# Altium schematic sheet AES3_Transceiver.SchDoc
size A4; CompanyName: imaginary Audio; Organization: imaginary Audio; Address1: 6903 101 Ave NW; Address2: Edmonton; Address3: AB; Address4: T6A 0H6; DocumentNumber: 3; Revision: 0.1; SheetNumber: 3; SheetTotal: 4; Designer: Gabriel Bessette
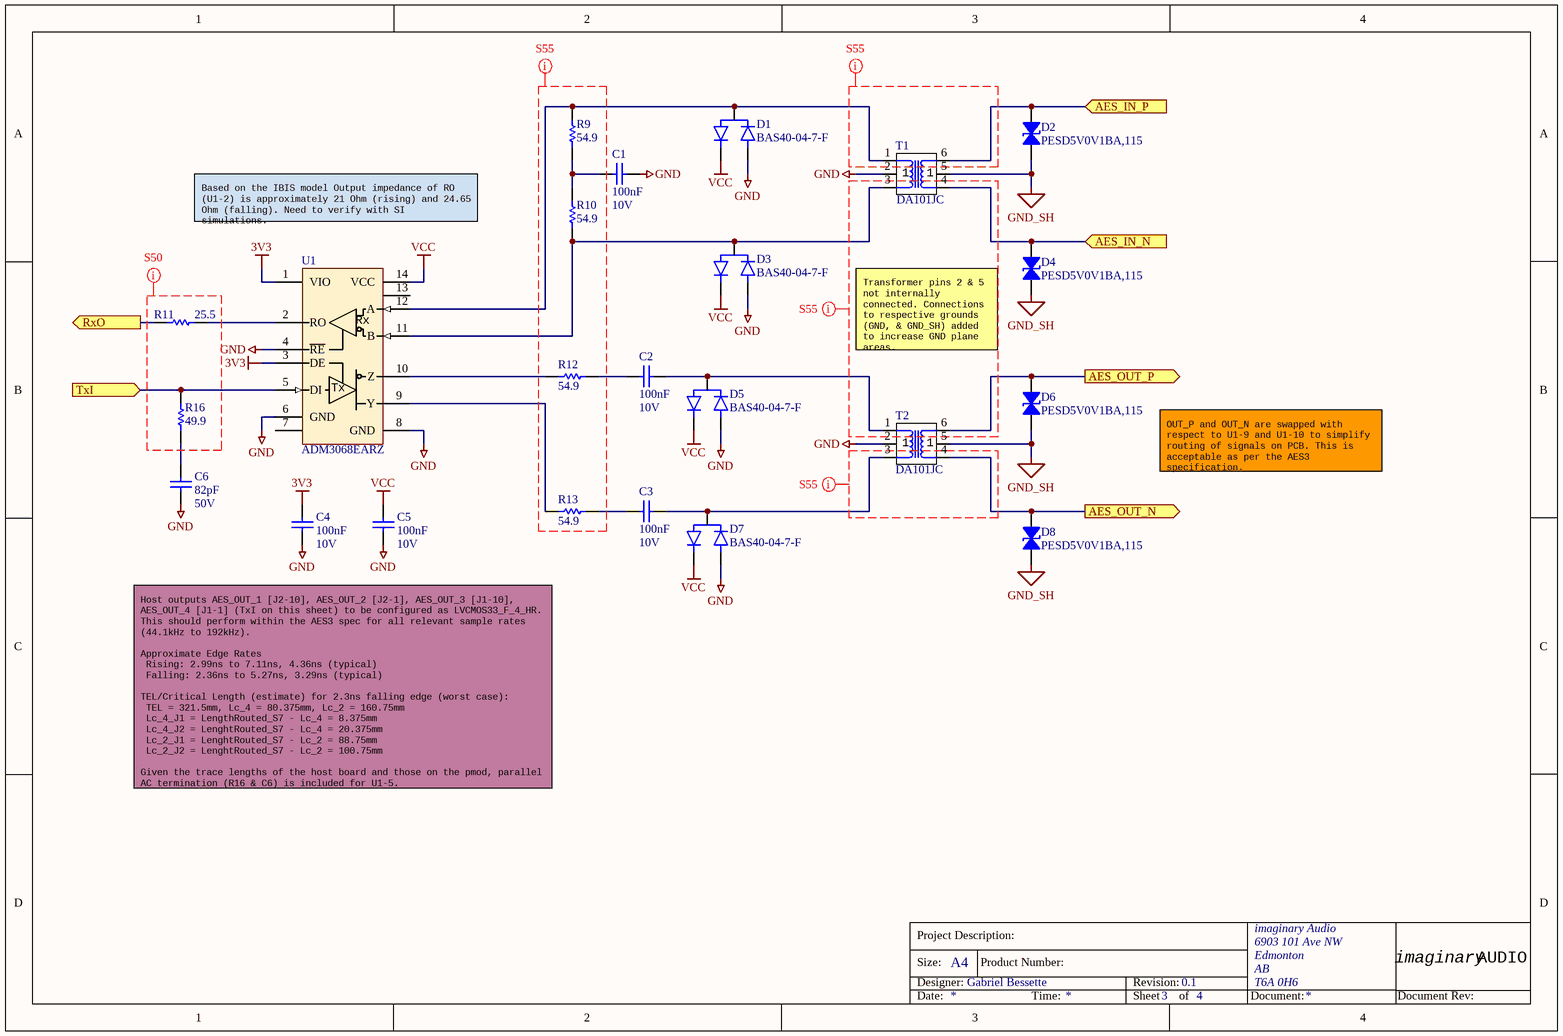
[diagram p0: AES3_Transceiver.SchDoc]

## Parts
C1  100nF  Voltage: 10V  [CAPC0603(1608)100_N]
C2  100nF  Voltage: 10V  [CAPC0603(1608)100_N]
C3  100nF  Voltage: 10V  [CAPC0603(1608)100_N]
C4  100nF  Voltage: 10V  [CAPC0603(1608)100_N]
C5  100nF  Voltage: 10V  [CAPC0603(1608)100_N]
C6  82pF  Voltage: 50V  [CAPC0603(1608)100_N]
D1  BAS40-04-7-F  [FP-SOT23-MFG]
D2  PESD5V0V1BA,115  [SOD323]
D3  BAS40-04-7-F  [FP-SOT23-MFG]
D4  PESD5V0V1BA,115  [SOD323]
D5  BAS40-04-7-F  [FP-SOT23-MFG]
D6  PESD5V0V1BA,115  [SOD323]
D7  BAS40-04-7-F  [FP-SOT23-MFG]
D8  PESD5V0V1BA,115  [SOD323]
R9  54.9  [RESC1608X55X30NL15T15]
R10  54.9  [RESC1608X55X30NL15T15]
R11  25.5  [RESC1608X55X30NL15T15]
R12  54.9  [RESC1608X55X30NL15T15]
R13  54.9  [RESC1608X55X30NL15T15]
R16  49.9  [RESC1608X55X30NL15T15]
T1  DA101JC  [DA101JC]
T2  DA101JC  [DA101JC]
U1  ADM3068EARZ  [SOIC127P600X175-14N]

## Ports
AES_IN_N (in), AES_IN_P (in), AES_OUT_N (out), AES_OUT_P (out), RxO (out), TxI (in)

## Nets
3V3: C4.2 U1.1(VIO) U1.3(DE)
GND: C1.2 C4.1 C5.1 C6.1 D1.1 D3.1 D5.1 D7.1 T1.2 T2.2 U1.4(~{RE}) U1.6(GND) U1.8(GND)
GND_SH: D2.2 D4.2 D6.2 D8.2 T1.5 T2.5
VCC: C5.2 D1.2 D3.2 D5.2 D7.2 U1.14(VCC)
AES_IN_N: D4.1 T1.4 ; port AES_IN_N
AES_IN_P: D2.1 T1.6 ; port AES_IN_P
AES_OUT_N: D8.1 T2.4 ; port AES_OUT_N
AES_OUT_P: D6.1 T2.6 ; port AES_OUT_P
RxO: R11.1 ; port RxO
TxI: R16.2 U1.5(DI) ; port TxI
NetC1_1: C1.1 R9.1 R10.2
NetC2_1: C2.1 R12.1
NetC2_2: C2.2 D5.3 T2.1
NetC3_1: C3.1 R13.1
NetC3_2: C3.2 D7.3 T2.3
NetC6_2: C6.2 R16.1
NetD1_3: D1.3 R9.2 T1.1 U1.12(A)
NetD3_3: D3.3 R10.1 T1.3 U1.11(B)
NetR11_2: R11.2 U1.2(RO)
NetR12_2: R12.2 U1.10(Z)
NetR13_2: R13.2 U1.9(Y)

Not connected (* = marked no-connect by the designer): U1 7(NIC) 13(NIC)

## Layout directives
net class S55: (no net found under the mark)
net class S50: (no net found under the mark)

## Notes on the sheet
- Based on the IBIS model Output impedance of RO (U1-2) is approximately 21 Ohm (rising) and 24.65 Ohm (falling). Need to verify with SI simulations.
- (near D4) Transformer pins 2 & 5 not internally connected. Connections to respective grounds (GND, & GND_SH) added to increase GND plane areas.
- OUT_P and OUT_N are swapped with respect to U1-9 and U1-10 to simplify routing of signals on PCB. This is acceptable as per the AES3 specification.
- Host outputs AES_OUT_1 [J2-10], AES_OUT_2 [J2-1], AES_OUT_3 [J1-10], AES_OUT_4 [J1-1] (TxI on this sheet) to be configured as LVCMOS33_F_4_HR. This should perform within the AES3 spec for all relevant sample rates (44.1kHz to 192kHz).
  Approximate Edge Rates
  Rising: 2.99ns to 7.11ns, 4.36ns (typical)
  Falling: 2.36ns to 5.27ns, 3.29ns (typical)
  TEL/Critical Length (estimate) for 2.3ns falling edge (worst case):
  TEL = 321.5mm, Lc_4 = 80.375mm, Lc_2 = 160.75mm
  Lc_4_J1 = LengthRouted_S7 - Lc_4 = 8.375mm
  Lc_4_J2 = LenghtRouted_S7 - Lc_4 = 20.375mm
  Lc_2_J1 = LenghtRouted_S7 - Lc_2 = 88.75mm
  Lc_2_J2 = LenghtRouted_S7 - Lc_2 = 100.75mm
  Given the trace lengths of the host board and those on the pmod, parallel AC termination (R16 & C6) is included for U1-5.
- Project Description:
- Size:
- Designer:
- A4
- Product Number:
- Revision:
- imaginary
- AUDIO
- Date:
- Time:
- Sheet
- of
- Document:
- Document Rev:
- (in symbol ADM3068EARZ) Rx; Tx

## Library data of the parts
C1-C5 = CAP: KEMET - C0603C104K8RACTU - SMD Multilayer Ceramic Capacitor, 0.1 µF, 10 V, 0603 [1608 Metric], ± 10%, X7R, C Series KEMET; Dissipation Factor: 5%; Max Thickness: 1 mm; Value: 100nF; Technology: SMT; Supplier 1: Digi-Key; Supplier Part Number 1: 399-1095-1-ND; Manufacturer: KEMET; Manufacturer Part Number: C0603C104K8RACTU; RoHS: Yes; Category: Ceramic Capacitors; Stock 1: 795093; Pricing 1: 1=0.12000, 10=0.08500, 50=0.04860, 100=0.04020, 500=0.02818, 1000=0.02333 (USD); Mount: Surface Mount,PCB; Case/Package: 0603; Number of Pins: 2; Case Code (Imperial): 0603; Case Code (Metric): 1608; Contact Plating: Tin,Matte; Dielectric Material: Ceramic; Min Operating Temperature: -55°C; Max Operating Temperature: 125°C; Capacitance: 100nF; Tolerance: 10%; Voltage Rating: 10V; Packaging: Tape and Reel; Package Quantity: 1; Voltage Rating (DC): 10V; Dielectric: X7R; Termination: SMD/SMT; Length: 1.6mm; Height: 0.8mm; Width: 0.8mm; Lead Pitch: 0.7mm; Thickness: 0.034inch; Depth: 0.8mm; Radiation Hardening: No; REACH SVHC: No SVHC; ComponentLink1URL: https://datasheet.ciiva.com/6093/1776114-6093269.pdf?src-supplier=Farnell; ComponentLink1Description: https://datasheet.ciiva.com/6093/1776114-6093269.pdf?src-supplier=Farnell; ComponentLink2URL: https://datasheet.ciiva.com/7823/kem-c1002-x7r-smd-7823989.pdf?src-supplier=Element14; ComponentLink2Description: https://datasheet.ciiva.com/7823/kem-c1002-x7r-smd-7823989.pdf?src-supplier=Element14; ComponentLink3URL: https://datasheet.ciiva.com/18192/getdatasheetpartid-91529-18192711.pdf?src-supplier=Verical; ComponentLink3Description: https://datasheet.ciiva.com/18192/getdatasheetpartid-91529-18192711.pdf?src-supplier=Verical; ComponentLink4URL: https://datasheet.ciiva.com/5419/kem-c1002-x7r-smd-357932-5419657.pdf?src-supplier=Mouser; ComponentLink4Description: https://datasheet.ciiva.com/5419/kem-c1002-x7r-smd-357932-5419657.pdf?src-supplier=Mouser; ComponentLink5URL: https://datasheet.ciiva.com/14589/70095383-14589402.pdf?src-supplier=Allied+Electronics; ComponentLink5Description: https://datasheet.ciiva.com/14589/70095383-14589402.pdf?src-supplier=Allied+Electronics; ComponentLink6URL: https://datasheet.ciiva.com/14593/70095383-14593978.pdf?src-supplier=Allied+Electronics; ComponentLink6Description: https://datasheet.ciiva.com/14593/70095383-14593978.pdf?src-supplier=Allied+Electronics
C6 = CAP: KEMET - C0603C820J5GACTU - Keramikvielschichtkondensator, SMD, 82 pF, 50 V, 0603 [Metrisch 1608], ± 5%, C0G / NP0; Dielectric Material: Ceramic; Temperature Coefficient: 30ppm/°C; Dissipation Factor: 0.1%; Max Thickness: 1 mm; Value: 82pF; Technology: SMT; Supplier 1: Digi-Key; Supplier Part Number 1: 399-1060-1-ND; Manufacturer: KEMET; Manufacturer Part Number: C0603C820J5GACTU; RoHS: Yes; Category: Ceramic Capacitors; Stock 1: 36463; Pricing 1: 1=0.10000, 10=0.05300, 50=0.02900, 100=0.02370, 500=0.01694, 1000=0.01331 (USD); Mount: Surface Mount,PCB; Case/Package: 0603; Number of Pins: 2; Case Code (Metric): 1608; Case Code (Imperial): 0603; Contact Material: Tin; Min Operating Temperature: -55°C; Max Operating Temperature: 125°C; Package Quantity: 1; Capacitance: 82pF; Voltage Rating: 50V; Tolerance: 5%; Packaging: Tape and Reel; Voltage Rating (DC): 50V; Dielectric: C0G; Termination: SMD/SMT; Length: 1.6mm; Width: 0.031inch; Height: 0.8mm; Thickness: 0.034inch; Lead Pitch: 0.7mm; Depth: 0.8mm; Radiation Hardening: No; REACH SVHC: No SVHC; Lead Free: Lead Free; ComponentLink1URL: https://datasheet.ciiva.com/144/docfinderpartnumber-c0603c820j5gactu-144400.pdf?src-supplier=Digi-Key; ComponentLink1Description: https://datasheet.ciiva.com/144/docfinderpartnumber-c0603c820j5gactu-144400.pdf?src-supplier=Digi-Key; ComponentLink2URL: https://datasheet.ciiva.com/26948/getdatasheetpartid-385592-26948455.pdf?src-supplier=Verical; ComponentLink2Description: https://datasheet.ciiva.com/26948/getdatasheetpartid-385592-26948455.pdf?src-supplier=Verical; ComponentLink3URL: https://datasheet.ciiva.com/28696/1789732-28696009.pdf?src-supplier=Element14; ComponentLink3Description: https://datasheet.ciiva.com/28696/1789732-28696009.pdf?src-supplier=Element14; ComponentLink4URL: https://datasheet.ciiva.com/5420/kem-c1003-c0g-smd-356956-5420651.pdf?src-supplier=Mouser; ComponentLink4Description: https://datasheet.ciiva.com/5420/kem-c1003-c0g-smd-356956-5420651.pdf?src-supplier=Mouser; ComponentLink5URL: https://datasheet.ciiva.com/22705/1907778-22705499.pdf?src-supplier=Element14; ComponentLink5Description: https://datasheet.ciiva.com/22705/1907778-22705499.pdf?src-supplier=Element14; ComponentLink6URL: https://datasheet.ciiva.com/7823/40889-7823855.pdf?src-supplier=Element14; ComponentLink6Description: https://datasheet.ciiva.com/7823/40889-7823855.pdf?src-supplier=Element14
D1 D3 D5 D7 = BAS40-04-7-F: DIODE SCHOTTKY 40V 350MW SOT23-3; Manufacturer: Diodes Inc.; Automotive Grade: Grade 1; Forward Current: 200mA; Max Junction Temp: +125°C; Peak Reverse Current: 0.02uA; VALUE: 4pF; Standoff Height: 0.013mm; Max Surge Forward Current: 600mA; Reverse Recovery Time: 5ns; Max Reverse Current: 200nA; Forward Voltage: 1V; ComponentLink2Description: Datasheet; Temperature Range High: +125°C; Mouser Description: Schottky Diodes & Rectifiers 40V 350mW; Reverse Voltage: 40V; Device Class L3: Schottky Diodes; Package: SOT23; Automotive: Yes; Max Repetitive Reverse Voltage: 40V; Height: 1.1mm; RoHS: TRUE; Device Class L1: Discrete Semiconductors; Temperature Range Low: -55°C; Digikey Description: DIODE ARRAY SCHOTTKY 40V SOT23-3; Lead Free: Yes; Category: Diode; Octopart: https://octopart.com/bas40-04-7-f-diodes+inc.-325979; Device Class L2: Diodes; Capacitance: 4pF; ComponentLink2URL: https://www.diodes.com/assets/Datasheets/ds11006.pdf; Manufacturer Part Number: BAS40-04-7-F; Footprint Url: https://www.diodes.com/assets/Package-Files/SOT23.pdf; Temperature: -55°C to +125°C; Supplier 1: Digi-Key; Supplier Part Number 1: BAS40-04FDICT-ND; Stock 1: 246869; Pricing 1: 1=0.21000, 10=0.17400, 100=0.07110, 500=0.05930, 1000=0.04121 (USD); Mount: Surface Mount; Case/Package: SOT-23; Number of Pins: 3; Weight: 0.000282oz; Contact Plating: Tin,Matte; Min Operating Temperature: -55°C; Max Operating Temperature: 125°C; Max Repetitive Reverse Voltage (Vrrm): 40V; Peak Non-Repetitive Surge Current: 600mA; Package Quantity: 3000; Packaging: Tape and Reel; Max Power Dissipation: 350mW; Average Rectified Current: 200mA; Max Forward Surge Current (Ifsm): 600mA; Power Dissipation: 350mW; Power Rating: 350mW; Max Reverse Voltage (DC): 40V; Termination: SMD/SMT; Length: 3.05mm; Width: 1.4mm; Radiation Hardening: No; REACH SVHC: No SVHC; ComponentLink1URL: https://datasheet.ciiva.com/25946/ds11006-25946962.pdf?src-supplier=Avnet+Europe; ComponentLink1Description: https://datasheet.ciiva.com/25946/ds11006-25946962.pdf?src-supplier=Avnet+Europe; ComponentLink3URL: https://datasheet.ciiva.com/1177/ds11006-1177656.pdf?src-supplier=Element14; ComponentLink3Description: https://datasheet.ciiva.com/1177/ds11006-1177656.pdf?src-supplier=Element14; ComponentLink4URL: https://datasheet.ciiva.com/22695/1911827-22695788.pdf?src-supplier=Element14; ComponentLink4Description: https://datasheet.ciiva.com/22695/1911827-22695788.pdf?src-supplier=Element14; ComponentLink5URL: https://datasheet.ciiva.com/16379/ds11006-16379065.pdf?src-supplier=Future+Electronics; ComponentLink5Description: https://datasheet.ciiva.com/16379/ds11006-16379065.pdf?src-supplier=Future+Electronics; ComponentLink6URL: https://datasheet.ciiva.com/8303/ds11006-8303212.pdf?src-supplier=Avnet; ComponentLink6Description: https://datasheet.ciiva.com/8303/ds11006-8303212.pdf?src-supplier=Avnet; ComponentLink7URL: https://datasheet.ciiva.com/4715/ds11006-4715662.pdf?src-supplier=Mouser; ComponentLink7Description: https://datasheet.ciiva.com/4715/ds11006-4715662.pdf?src-supplier=Mouser
D2 D4 D6 D8 = PESD5V0V1BA,115: TVS DIODE 5V 12.5V SOD323; Manufacturer: Nexperia USA Inc.; Bidirectional Channels: 1; Capacitance @ Frequency: 11pF @ 1MHz; Current - Peak Pulse (10/1000µs): 4.8A (8/20µs); Power Line Protection: No; Power - Peak Pulse: 45W; Type: Zener; Voltage - Breakdown (Min): 5.8V; Voltage - Reverse Standoff (Typ): 5V (Max); Part Number: PESD5V0V1BA,115; Applications: Automotive; ComponentLink1Description: Datasheet; ComponentLink1URL: https://assets.nexperia.com/documents/data-sheet/PESD5V0V1BA_BB_BL.pdf; ComponentLink2Description: DigiKey Link; ComponentLink2URL: http://digikey.com/product-detail/en/nexperia-usa-inc/PESD5V0V1BA115/1727-5807-1-ND/2697413; LastUpdated: 2020-09-02 1:28:29 AM; Lifecycle Status: Active; Minimum Order: 1; Mounting Type: Surface Mount; Operating Temperature: -55°C ~ 150°C (TA); Package / Case: SC-76, SOD-323; Packaging: TapeAndReel; PartId: 9963; Part Status: Active; Price: 0.07; Series: Automotive, AEC-Q101; Supplier 1: DigiKey; Supplier Part Number 1: 1727-5807-1-ND; Supplier Device Package: SOD-323; Voltage - Clamping (Max) @ Ipp: 12.5V
R9 R10 R12 R13 = RES: RES, THICK FILM, 54R9, 1%, 0.1W, 0603; Product Range:AEC-Q200 ERJ Series; Resistance:54.9ohm; Power Rating:100mW; Resistance Tolerance: 1%; Voltage Rating:75V; Resistor Case Style:0603 [1608 Metric]; Packaging:Cut Tape; MSL:- ;RoHS Compliant: Yes; Manufacturer Part Number: ERJ-3EKF54R9V; Resistance: 54.9R; Power Rating: 100mW; Voltage Rating: 75V; Temperature Coefficient: 100ppm/°C; Voltage Rating (DC): 50V; Value: 54.9; Supplier 1: Digi-Key; Supplier Part Number 1: P54.9HCT-ND; RoHS: Yes; Category: Chip SMD Resistors; Stock 1: 80631; Pricing 1: 1=0.10000, 10=0.03200, 100=0.01300, 1000=0.00583, 2500=0.00506 (USD); Mount: Surface Mount; Case/Package: 0603; Case Code (Imperial): 0603; Case Code (Metric): 1608; Contact Plating: Tin; Min Operating Temperature: -55°C; Max Operating Temperature: 155°C; Package Quantity: 1; Packaging: Tape and Reel; Tolerance: 1%; Resistor Type: Thick Film; Number of Terminations: 2; Max Power Dissipation: 100mW; Features: Automotive AEC-Q200; Length: 1.6mm; Height: 0.022inch; Width: 0.8mm; Depth: 0.8mm; REACH SVHC: No SVHC; Military Standard: Not; Lead Free: Lead Free; ComponentLink1URL: https://datasheet.ciiva.com/30100/aoa0000ce2-30100792.pdf?src-supplier=Onlinecomponents.com; ComponentLink1Description: https://datasheet.ciiva.com/30100/aoa0000ce2-30100792.pdf?src-supplier=Onlinecomponents.com; ComponentLink2URL: https://datasheet.ciiva.com/9188/aoa0000ce2-9188777.pdf?src-supplier=Avnet; ComponentLink2Description: https://datasheet.ciiva.com/9188/aoa0000ce2-9188777.pdf?src-supplier=Avnet; ComponentLink3URL: https://datasheet.ciiva.com/43460/426256-43460426.pdf?src-supplier=Farnell; ComponentLink3Description: https://datasheet.ciiva.com/43460/426256-43460426.pdf?src-supplier=Farnell; ComponentLink4URL: https://datasheet.ciiva.com/46388/426256-46388764.pdf?src-supplier=Element14; ComponentLink4Description: https://datasheet.ciiva.com/46388/426256-46388764.pdf?src-supplier=Element14
R11 = RES: RES SMD 25.5 OHM 1% 1/10W 0603; Manufacturer Part Number: ERJ-3EKF25R5V; Resistance: 25.5R; Power Rating: 100mW; Voltage Rating: 75V; Temperature Coefficient: 100ppm/°C; Voltage Rating (DC): 50V; Value: 25.5; Supplier 1: Digi-Key; Supplier Part Number 1: P25.5HCT-ND; RoHS: Yes; Category: Chip SMD Resistors; Stock 1: 195327; Pricing 1: 1=0.10000, 10=0.03200, 100=0.01300, 1000=0.00583, 2500=0.00506 (USD); Mount: Surface Mount; Case/Package: 0603; Case Code (Metric): 1608; Case Code (Imperial): 0603; Weight: 7.1E-05oz; Contact Plating: Tin; Min Operating Temperature: -55°C; Max Operating Temperature: 155°C; Tolerance: 1%; Packaging: Tape and Reel; Package Quantity: 1; Resistor Type: Thick Film; Number of Terminations: 2; Termination: SMD/SMT; Max Power Dissipation: 100mW; Features: Automotive AEC-Q200; Length: 0.063inch; Width: 0.031inch; Height: 0.022inch; REACH SVHC: Yes; Lead Free: Lead Free; ComponentLink1URL: https://datasheet.ciiva.com/46419/1678782-46419831.pdf?src-supplier=Element14; ComponentLink1Description: https://datasheet.ciiva.com/46419/1678782-46419831.pdf?src-supplier=Element14; ComponentLink2URL: https://datasheet.ciiva.com/22667/1678782-22667770.pdf?src-supplier=Element14; ComponentLink2Description: https://datasheet.ciiva.com/22667/1678782-22667770.pdf?src-supplier=Element14; ComponentLink3URL: https://datasheet.ciiva.com/30155/aoa0000ce2-30155996.pdf?src-supplier=Onlinecomponents.com; ComponentLink3Description: https://datasheet.ciiva.com/30155/aoa0000ce2-30155996.pdf?src-supplier=Onlinecomponents.com; ComponentLink4URL: https://datasheet.ciiva.com/7777/1678782-7777965.pdf?src-supplier=Element14; ComponentLink4Description: https://datasheet.ciiva.com/7777/1678782-7777965.pdf?src-supplier=Element14
R16 = RES: PANASONIC - ERJ-3EKF49R9V. - Resistor Case Style:0603 [1608 Metric]; Manufacturer Part Number: ERJ3EKF49R9V; Resistance: 49.9R; Tolerance: 1%; Temperature Coefficient: 100ppm/°C; Power Rating: 100mW; Voltage Rating: 75V; Voltage Rating (DC): 50V; Working Voltage: 6V; Value: 49.9; Supplier 1: Digi-Key; Supplier Part Number 1: P49.9HCT-ND; RoHS: Yes; Category: Chip SMD Resistors; Stock 1: 316454; Pricing 1: 1=0.10000, 10=0.03200, 100=0.01300, 1000=0.00583, 2500=0.00506 (USD); Mount: Surface Mount; Case/Package: 0603; Contact Plating: Tin; Case Code (Imperial): 0603; Case Code (Metric): 1608; Min Operating Temperature: -55°C; Max Operating Temperature: 155°C; Resistor Type: Thick Film; Packaging: Tape and Reel; Package Quantity: 5000; Number of Terminations: 2; Termination: SMD/SMT; Max Power Dissipation: 100mW; Features: Automotive AEC-Q200; Length: 1.6mm; Width: 0.8mm; Height: 0.022inch; Depth: 0.8mm; Radiation Hardening: No; REACH SVHC: Unknown; Military Standard: Not; Lead Free: Lead Free; ComponentLink1URL: https://datasheet.ciiva.com/9117/aoa0000ce2-9117128.pdf?src-supplier=Avnet; ComponentLink1Description: https://datasheet.ciiva.com/9117/aoa0000ce2-9117128.pdf?src-supplier=Avnet; ComponentLink2URL: https://datasheet.ciiva.com/16772/70260748-16772570.pdf?src-supplier=Allied+Electronics; ComponentLink2Description: https://datasheet.ciiva.com/16772/70260748-16772570.pdf?src-supplier=Allied+Electronics; ComponentLink3URL: https://datasheet.ciiva.com/28694/1678782-28694219.pdf?src-supplier=Element14; ComponentLink3Description: https://datasheet.ciiva.com/28694/1678782-28694219.pdf?src-supplier=Element14; ComponentLink4URL: https://datasheet.ciiva.com/46388/1678782-46388908.pdf?src-supplier=Element14; ComponentLink4Description: https://datasheet.ciiva.com/46388/1678782-46388908.pdf?src-supplier=Element14; ComponentLink5URL: https://datasheet.ciiva.com/16766/70260748-16766262.pdf?src-supplier=Allied+Electronics; ComponentLink5Description: https://datasheet.ciiva.com/16766/70260748-16766262.pdf?src-supplier=Allied+Electronics; ComponentLink6URL: https://datasheet.ciiva.com/30095/aoa0000ce2-30095355.pdf?src-supplier=Onlinecomponents.com; ComponentLink6Description: https://datasheet.ciiva.com/30095/aoa0000ce2-30095355.pdf?src-supplier=Onlinecomponents.com; ComponentLink7URL: https://datasheet.ciiva.com/48531/aoa0000ce2-48531019.pdf?src-supplier=Avnet; ComponentLink7Description: https://datasheet.ciiva.com/48531/aoa0000ce2-48531019.pdf?src-supplier=Avnet
T1 T2 = DA101JC: TRANS, Digital Audio 1:1 2000Vrms 6Term. Gull Wing SMD; Manufacturer: Murata; Inductance: 2.06mH; Isolation Voltage: 2kV; Inductance A: 1.6mH; Coupling Factor: 0.999; Supplier 1: Digi-Key; Supplier Part Number 1: 811-3121-ND; RoHS: Yes; Category: Uncategorized; Pricing 1: 1=1.57000, 10=1.55000, 25=1.53000, 50=1.50000, 100=1.42000, 250=1.32000, 500=1.24000, 1000=1.22360 (USD); Mount: Through Hole,Surface Mount; Number of Pins: 6; Weight: 0.032805oz; Min Operating Temperature: -40°C; Max Operating Temperature: 85°C; Turns Ratio: 1:1; Packaging: Rail/Tube; Package Quantity: 50; Lead/Base Style: Gull Wing; Termination: SMD/SMT; Length: 9.52mm; Height: 6.35mm; Width: 9mm; Height - Seated (Max): 6.35mm; Depth: 12.7mm; ComponentLink1URL: https://datasheet.ciiva.com/3293/kmp-da100j-3293148.pdf?src-supplier=Avnet; ComponentLink1Description: https://datasheet.ciiva.com/3293/kmp-da100j-3293148.pdf?src-supplier=Avnet; Supplier 2: Mouser; Supplier Part Number 2: 580-DA101JC; Manufacturer Part Number: DA101JC; Inductance B: 1.6mH
U1 = ADM3068EARZ: XCVR, Full-Duplex, RS-485, 50 Mbps; Manufacturer: Analog Devices; Supplier 1: Mouser; Supplier Part Number 1: 584-ADM3068EARZ; RoHS: No; Stock 1: 364; Pricing 1: 1=3.71000, 10=3.33000, 25=3.14000, 100=2.58000, 250=2.32000, 500=2.24000, 1000=1.88000, 2500=1.82000, 5000=1.77000 (USD); Supplier 2: Digi-Key; Supplier Part Number 2: 505-ADM3068EARZ-ND; Manufacturer Part Number: ADM3068EARZ